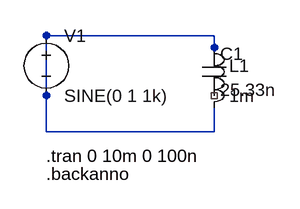
[diagram p0: schematic lc_resonanz.asc]
lc_resonanz.asc, the LTspice schematic file:
Version 4
SHEET 1 880 680
WIRE 48 160 48 160
WIRE 272 160 48 160
WIRE 272 176 272 160
WIRE 48 288 48 160
WIRE 48 288 272 288
WIRE 272 288 272 256
SYMBOL ind 256 160 R0
SYMATTR InstName L1
SYMATTR Value 1m
SYMBOL cap 256 176 R0
SYMATTR InstName C1
SYMATTR Value 25.33n
SYMBOL voltage 48 144 R0
WINDOW 123 0 0 Left 0
WINDOW 39 0 0 Left 0
SYMATTR InstName V1
SYMATTR Value SINE(0 1 1k)
TEXT 48 320 Left 2 !.tran 0 10m 0 100n
TEXT 48 344 Left 2 !.backanno

The netlist it stands for:
* lc_resonanz.asc
L1 N001 N001 1m
C1 N001 NC_01 25.33n
V1 N001 N001 SINE(0 1 1k)
.tran 0 10m 0 100n
.backanno
.backanno
.end